# Altium schematic sheet PDM-S11-V00-IMU.SchDoc: IMU
size A3; DrawnBy: Zoe Goodward; Organization: QUT Motorsport; Address1: O-120, Gardens Point; Address2: 2 George Street; Address3: Brisbane, QLD 4000; Address4: Australia; DocumentNumber: ####; Revision: 01; SheetNumber: 1; SheetTotal: 1; Version: 01; Project: Power Distribution Module; PageSetup: Record=PageOptions|CenterHorizontal=True|CenterVertical=True|PrintScale=0.97|XCorrection=1.00|YCorrection=1.00|PrintKind=0|BorderSize=5000000|LeftOffset=0|BottomOffset=0|Orientation=2|PaperLength=1000|PaperWidth=1000|Scale=100|PaperSource=7|PrintQuality=-4|MediaType=1|DitherType=10|PaperKind=A4|PrintScaleMode=1
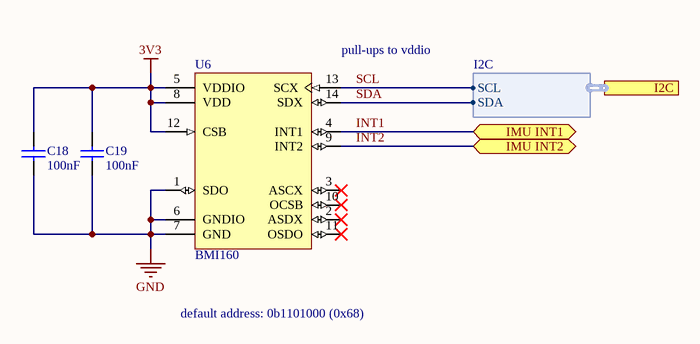
[diagram p0: PDM-S11-V00-IMU.SchDoc]

## Parts
C18  100nF  [Cap_Ceramic_0603]
C19  100nF  [Cap_Ceramic_0603]
U6  BMI160  [BOSC-BMI160_V]

## Ports
I2C (harness I2C), IMU INT1 (bidir), IMU INT2 (bidir)

## Harnesses
I2C: SDA, SCL

## Nets
3V3: C18.2 C19.2 U6.5(VDDIO) U6.8(VDD) U6.12(CSB)
GND: C18.1 C19.1 U6.1(SDO) U6.6(GNDIO) U6.7(GND)
INT1: U6.4(INT1) ; port IMU INT1
INT2: U6.9(INT2) ; port IMU INT2
SCL: U6.13(SCX) ; port I2C.SCL
SDA: U6.14(SDX) ; port I2C.SDA

Not connected (* = marked no-connect by the designer): U6 2(ASDX)* 3(ASCX)* 10(OCSB)* 11(OSDO)*

## Notes on the sheet
- (near U6) pull-ups to vddio
- default address: 0b1101000 (0x68)
- Revision History:
- Sheet Title:
- Rev
- Date
- Description
- Project:
- Size:
- Drawn By:
- A3
- Number:
- Revision:
- Sheet
- Version:
- of
- QUT Motorsport
- O-120, Gardens Point
- 2 George Street
- Brisbane, QLD 4000
- Australia
- Print Date:
- Print Time:
- File Name:

## Library data of the parts
C18 C19 = 100nF 50V 5% X7R 0603: Capacitor, Ceramic, SMD, 100nF, 50V, 5%, X7R, 0603
U6 = BMI160: Small, low Power Inertial Measurement Unit, 1.2 to 3.6 V, -40 to 85 degC, 14-Pin LGA, Halogen-Free, Tape and Reel; Manufacturer: Bosch; Datasheet URL: https://ae-bst.resource.bosch.com/media/_tech/media/datasheets/BST-BMI160-DS000-07.pdf; Package Description: 14-Pullback Quad Flat No-Lead, Body 3 x 2.5 mm, Pitch 0.5 mm; Lead Free: LeadFree; Datasheet Version: Rev. 0.8, 02/2015; Mounting Technology: SurfaceMount; Manufacturer URL: https://www.bosch.com/; Package Reference: BMI160; RoHSCompliant: false